# Altium schematic sheet DB32_Hardware_Kit.SchDoc: DB32 Hardware Kit
size A4; Organization: Altium Limited.; Address1: Level 3, 12a Rodborough Rd; Address2: Frenchs Forest 2086; Address3: NSW; Address4: AUSTRALIA; DocumentNumber: 8; SheetNumber: 8; SheetTotal: 21
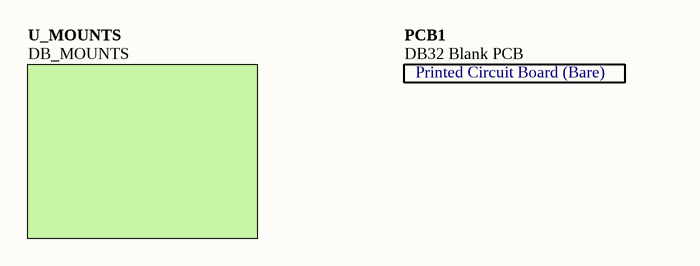
[diagram p0: DB32_Hardware_Kit.SchDoc]

## Parts
PCB1  DB32 Blank PCB  (mechanical)

## Sub-sheets
U_MOUNTS = DB_MOUNTS: no entries

## Notes on the sheet
- Sheet Title
- Project Title
- Size:
- Date:
- A4
- Assy:
- Time:
- Revision:
- Sheet
- of
- File:
- (in symbol D-810-0006) Printed Circuit Board (Bare)

## Library data of the parts
PCB1 = D-810-0006: DB32 Blank PCB - Daughter Board Lattice ECP LFECP33E-3FN672C; ProjectPath: DB32.PrjPCB; Status: Unreleased; Category: Blank PCB